# Altium schematic sheet URC_eZFET_Lite-Headers.SchDoc: URC Custom ez-FET Lite Headers
size Letter; DrawnBy: Marcus Behel; DocumentNumber: URC_ez-FET_Lite - 3; Revision: C; SheetNumber: 3; SheetTotal: 3
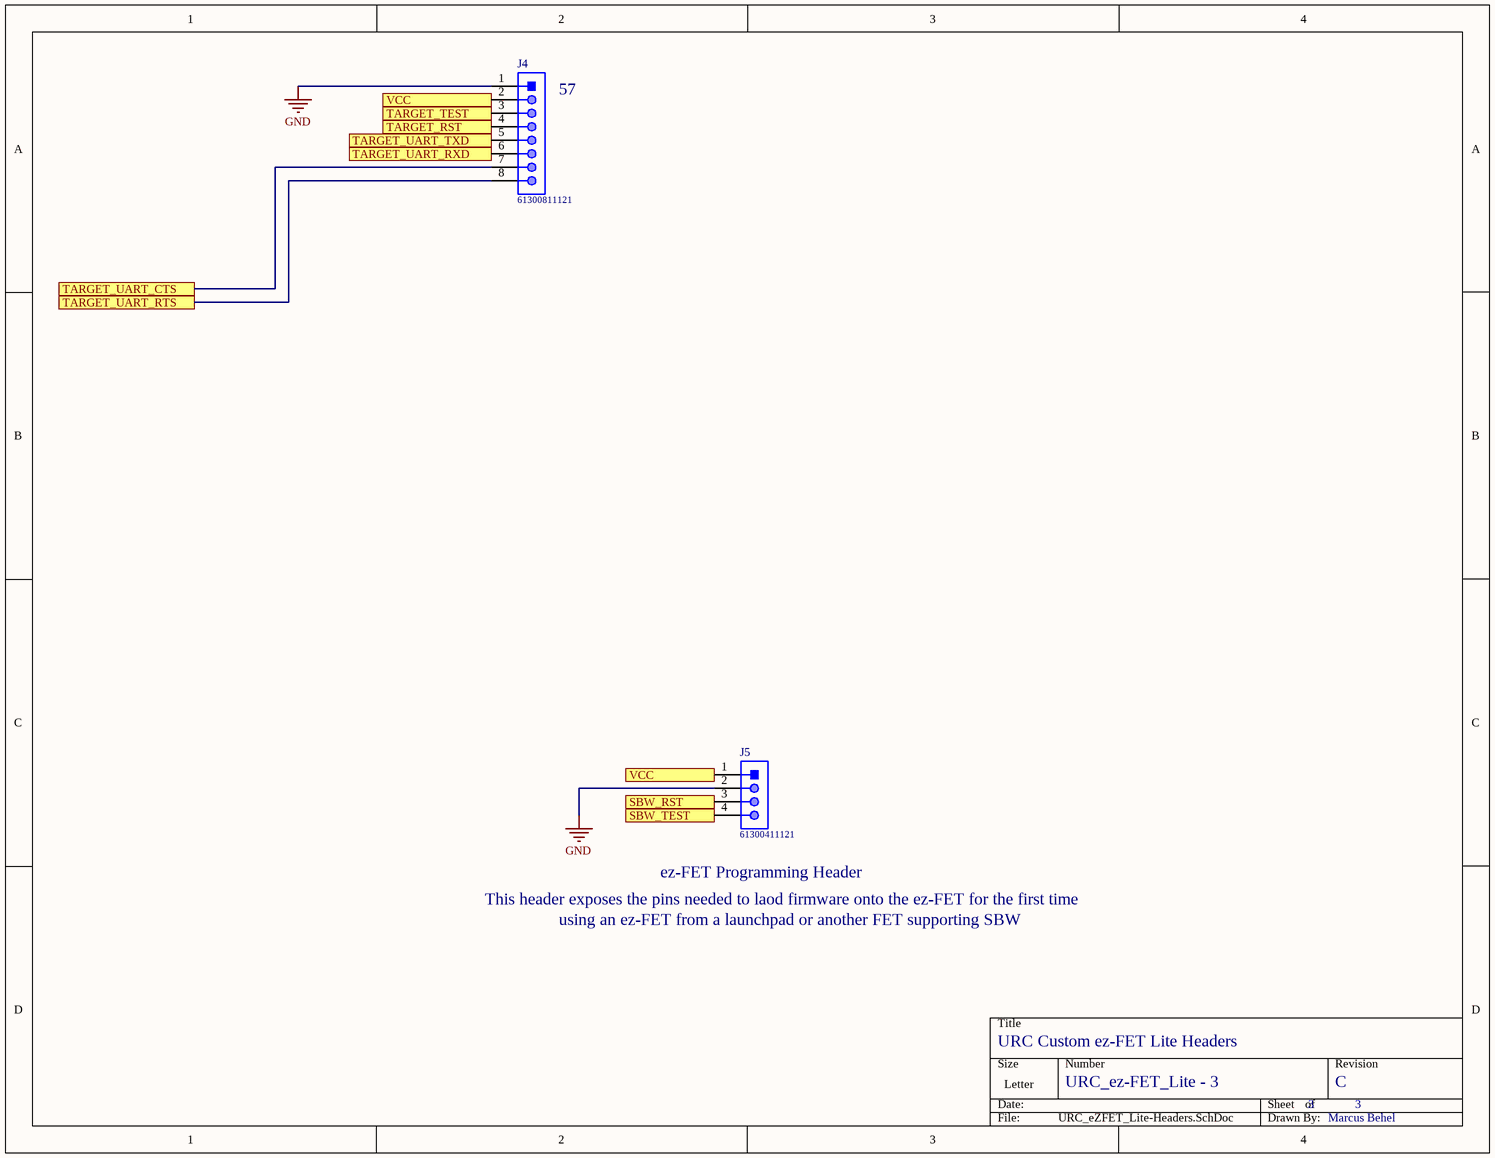
[diagram p0: URC_eZFET_Lite-Headers.SchDoc]

## Parts
J4  61300811121  [61300811121]
J5  61300411121  [61300411121]

## Ports
SBW_RST, SBW_TEST, TARGET_RST, TARGET_TEST, TARGET_UART_CTS, TARGET_UART_RTS, TARGET_UART_RXD, TARGET_UART_TXD, VCC

## Nets
GND: J4.1 J5.2
SBW_RST: J5.3 ; port SBW_RST
SBW_TEST: J5.4 ; port SBW_TEST
TARGET_RST: J4.4 ; port TARGET_RST
TARGET_TEST: J4.3 ; port TARGET_TEST
TARGET_UART_CTS: J4.7 ; port TARGET_UART_CTS
TARGET_UART_RTS: J4.8 ; port TARGET_UART_RTS
TARGET_UART_RXD: J4.6 ; port TARGET_UART_RXD
TARGET_UART_TXD: J4.5 ; port TARGET_UART_TXD
VCC: J4.2 J5.1 ; port VCC

## Notes on the sheet
- (near J4) 57
- This header exposes the pins needed to laod firmware onto the ez-FET for the first time
- (near J5) ez-FET Programming Header
- using an ez-FET from a launchpad or another FET supporting SBW

## Library data of the parts
J4 = CMP-1502-01076-1: THT Vertical Pin Header WR-PHD, Pitch 2.54 mm, Single Row, 8 pins; Manufacturer: Wurth Elektronik; Rated Current: 3A; Pin Number: 8; Working Voltage: 250VAC; Gender: Male; Contact Resistance: 20mOhm; Pitch: 2.54mm; Withstanding Voltage: 500VAC; Publisher: WurthElektronik; Operating Temperature: -40to105degC; Orientation: Vertical; Row Number: Single; Part Number: 61300811121; Package Reference: 61300811121; Mounting Technology: THT; Packaging: Bag; Manufacturer URL: http://www.we-online.de; Datasheet URL: https://katalog.we-online.de/em/datasheet/6130xx11121.pdf
J5 = CMP-1502-01064-1: THT Vertical Pin Header WR-PHD, Pitch 2.54 mm, Single Row, 4 pins; Manufacturer: Wurth Elektronik; Withstanding Voltage: 500VAC; Rated Current: 3A; Working Voltage: 250VAC; Pin Number: 4; Gender: Male; Contact Resistance: 20mOhm; Pitch: 2.54mm; Manufacturer URL: http://www.we-online.de; Operating Temperature: -40to105degC; Packaging: Bag; Mounting Technology: THT; Package Reference: 61300411121; Datasheet URL: https://katalog.we-online.de/em/datasheet/6130xx11121.pdf; Publisher: WurthElektronik; Part Number: 61300411121; Row Number: Single; Orientation: Vertical